# EAGLE design frontend8 (EAGLE 9.3.1)

## Sheet 1 of 3
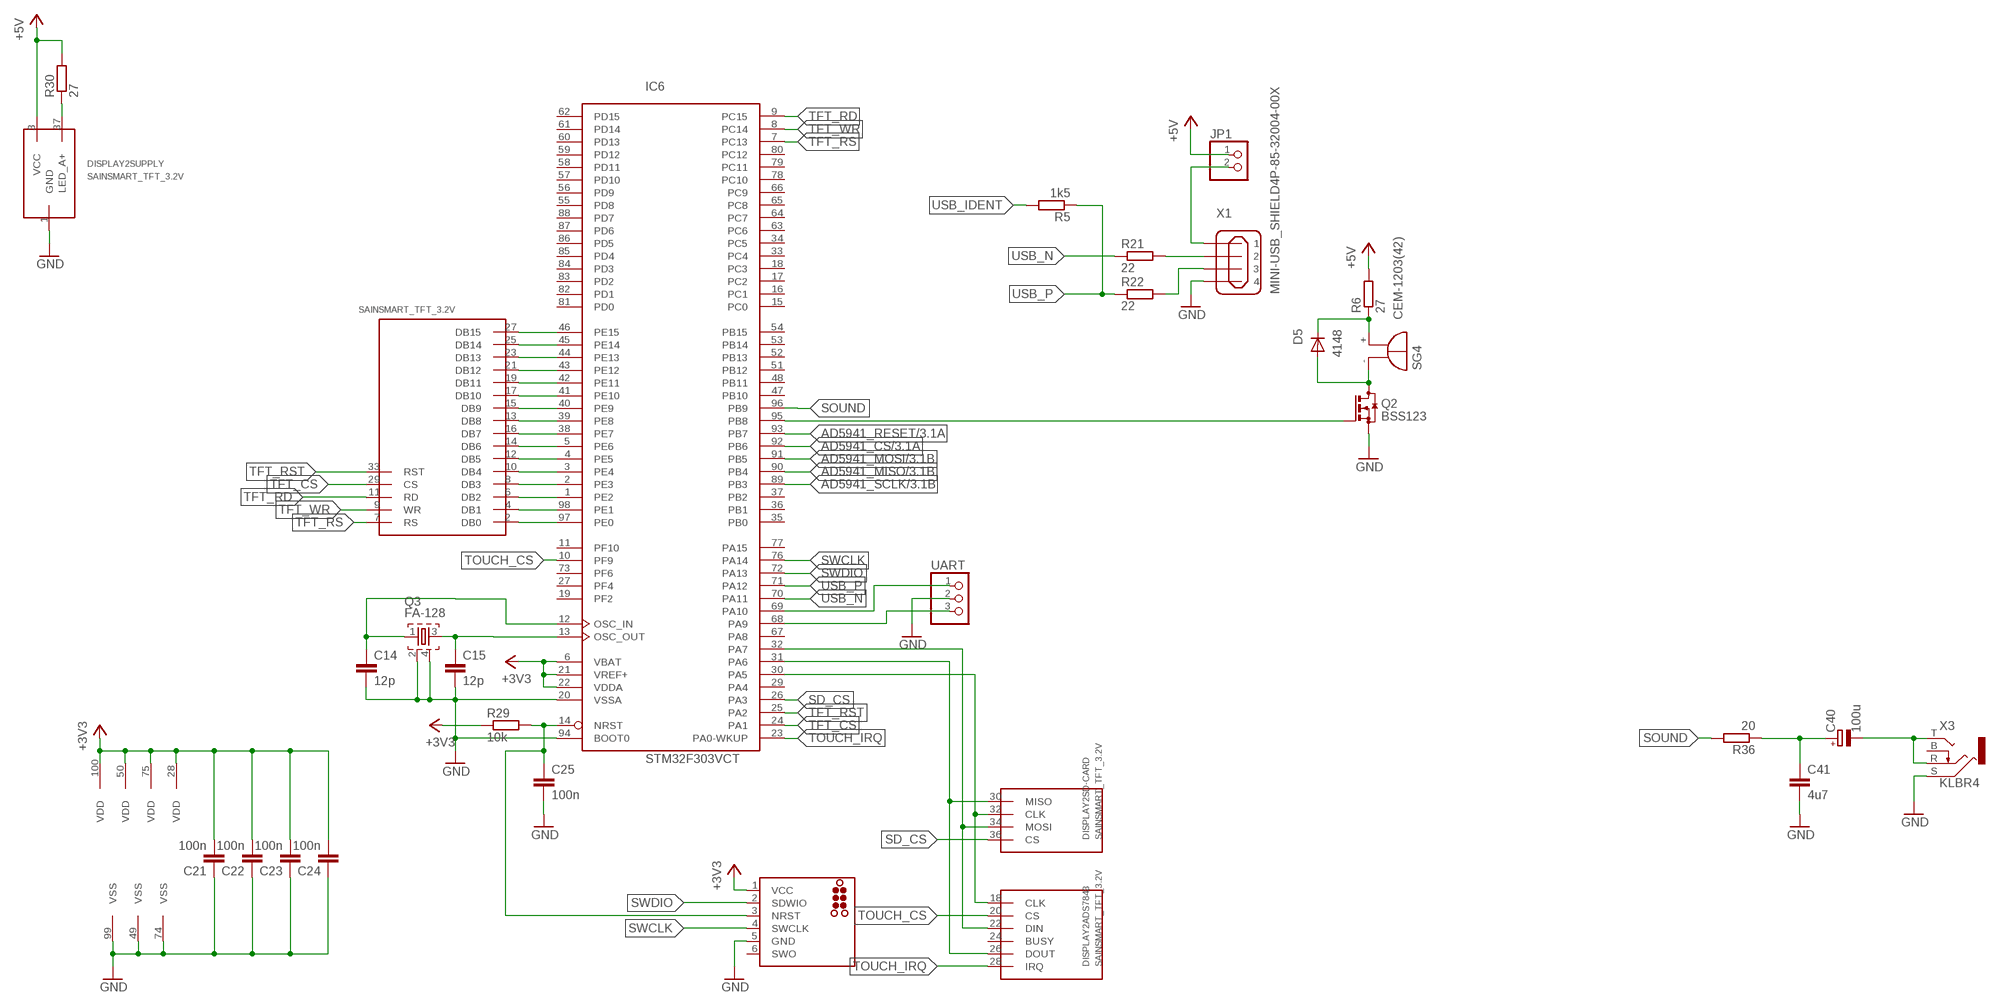
[diagram p0: schematic, sheet 1]

### Parts
C14  12p  C-EUC0603K  [C0603K]
C15  12p  C-EUC0603K  [C0603K]
C21  100n  C-EUC0603K  [C0603K]
C22  100n  C-EUC0603K  [C0603K]
C23  100n  C-EUC0603K  [C0603K]
C24  100n  C-EUC0603K  [C0603K]
C25  100n  C-EUC0603K  [C0603K]
C40  100u  CPOL-EUE2.5-5  [E2,5-5]
C41  4u7  C-EUC1206K  [C1206K]
D5  4148  DIODE-SOD123  [SOD123]
DISPLAY2  SAINSMART_TFT_3.2V  [SAINSMART_ANGLED]
IC6  STM32F303VCT  [LQFP100]
J1  TC2030-MCP  [TC2030-MCP]
JP1  PINHD-1X2  [1X02]
Q2  BSS123  [SOT23]
Q3  FA-128  [FA-128]
R5  1k5  R-EU_R0603  [R0603]
R6  27  R-EU_R1206  [R1206]
R21  22  R-EU_R0603  [R0603]
R22  22  R-EU_R0603  [R0603]
R29  10k  R-EU_R0603  [R0603]
R30  27  R-EU_R1206  [R1206]
R36  20  R-EU_R1206  [R1206]
SG4  CEM-1203(42)  F/QMBIII  [F/QMBIII]
UART  PINHD-1X3  [1X03]
X1  MINI-USB_SHIELD4P-85-32004-00X  [85-32004-00X]
X3  KLBR4  [KLBR4]

### Nets
+3V3: C21.2 C22.2 C23.2 C24.2 IC6.6(VBAT) IC6.21(VREF+) IC6.22(VDDA) IC6.28(VDD) IC6.50(VDD) IC6.75(VDD) IC6.100(VDD) J1.1(VCC) R29.1 ; also sheet 2,3
+5V: DISPLAY2.3(SUPPLY:VCC) JP1.1 R6.2 R30.2 ; also sheet 2
AD5941_CS: IC6.92(PB6) ; also sheet 3
AD5941_MISO: IC6.90(PB4) ; also sheet 3
AD5941_MOSI: IC6.91(PB5) ; also sheet 3
AD5941_RESET: IC6.93(PB7) ; also sheet 3
AD5941_SCLK: IC6.89(PB3) ; also sheet 3
GND: C14.2 C15.2 C21.1 C22.1 C23.1 C24.1 C25.2 C41.2 DISPLAY2.1(SUPPLY:GND) IC6.20(VSSA) IC6.49(VSS) IC6.74(VSS) IC6.94(BOOT0) IC6.99(VSS) J1.5(GND) Q2.2(S) Q3.2 Q3.4 UART.2 X1.4 X3.S ; also sheet 2,3
N$22: C40.+ C41.1 R36.1
N$38: IC6.95(PB8) Q2.1(G)
N$41: DISPLAY2.2(SSD1289:DB0) IC6.97(PE0)
N$42: C40.- X3.R X3.T
N$43: DISPLAY2.4(SSD1289:DB1) IC6.98(PE1)
N$44: DISPLAY2.6(SSD1289:DB2) IC6.1(PE2)
N$45: DISPLAY2.8(SSD1289:DB3) IC6.2(PE3)
N$46: DISPLAY2.22(ADS7843:DIN) DISPLAY2.34(SD-CARD:MOSI) IC6.32(PA7)
N$47: DISPLAY2.10(SSD1289:DB4) IC6.3(PE4)
N$48: DISPLAY2.12(SSD1289:DB5) IC6.4(PE5)
N$49: DISPLAY2.14(SSD1289:DB6) IC6.5(PE6)
N$50: DISPLAY2.16(SSD1289:DB7) IC6.38(PE7)
N$51: DISPLAY2.26(ADS7843:DOUT) DISPLAY2.30(SD-CARD:MISO) IC6.31(PA6)
N$52: DISPLAY2.18(ADS7843:CLK) DISPLAY2.32(SD-CARD:CLK) IC6.30(PA5)
N$53: C14.1 IC6.12(OSC_IN) Q3.1
N$54: C15.1 IC6.13(OSC_OUT) Q3.3
N$55: R21.2 X1.2
N$56: R22.2 X1.3
N$60: C25.1 IC6.14(NRST) J1.3(NRST) R29.2
N$61: DISPLAY2.37(SUPPLY:LED_A+) R30.1
N$62: DISPLAY2.13(SSD1289:DB8) IC6.39(PE8)
N$63: DISPLAY2.15(SSD1289:DB9) IC6.40(PE9)
N$64: DISPLAY2.17(SSD1289:DB10) IC6.41(PE10)
N$65: DISPLAY2.19(SSD1289:DB11) IC6.42(PE11)
N$66: JP1.2 X1.1
N$67: D5.C R6.1 SG4.+(-)
N$68: DISPLAY2.21(SSD1289:DB12) IC6.43(PE12)
N$69: DISPLAY2.23(SSD1289:DB13) IC6.44(PE13)
N$70: DISPLAY2.25(SSD1289:DB14) IC6.45(PE14)
N$71: DISPLAY2.27(SSD1289:DB15) IC6.46(PE15)
N$72: D5.A Q2.3(D) SG4.-(+)
RX: IC6.69(PA10) UART.1
SD_CS: DISPLAY2.36(SD-CARD:CS) IC6.26(PA3)
SOUND: IC6.96(PB9) R36.2
SWCLK: IC6.76(PA14) J1.4(SWCLK)
SWDIO: IC6.72(PA13) J1.2(SDWIO)
TFT_CS: DISPLAY2.29(SSD1289:CS) IC6.24(PA1)
TFT_RD: DISPLAY2.11(SSD1289:RD) IC6.9(PC15)
TFT_RS: DISPLAY2.7(SSD1289:RS) IC6.7(PC13)
TFT_RST: DISPLAY2.33(SSD1289:RST) IC6.25(PA2)
TFT_WR: DISPLAY2.9(SSD1289:WR) IC6.8(PC14)
TOUCH_CS: DISPLAY2.20(ADS7843:CS) IC6.10(PF9)
TOUCH_IRQ: DISPLAY2.28(ADS7843:IRQ) IC6.23(PA0-WKUP)
TX: IC6.68(PA9) UART.3
USB_IDENT: R5.2
USB_N: IC6.70(PA11) R21.1
USB_P: IC6.71(PA12) R5.1 R22.1
Unconnected: DISPLAY2.24(ADS7843:BUSY) IC6.11(PF10) IC6.15(PC0) IC6.16(PC1) IC6.17(PC2) IC6.18(PC3) IC6.19(PF2) IC6.27(PF4) IC6.29(PA4) IC6.33(PC4) IC6.34(PC5) IC6.35(PB0) IC6.36(PB1) IC6.37(PB2) IC6.47(PB10) IC6.48(PB11) IC6.51(PB12) IC6.52(PB13) IC6.53(PB14) IC6.54(PB15) IC6.55(PD8) IC6.56(PD9) IC6.57(PD10) IC6.58(PD11) IC6.59(PD12) IC6.60(PD13) IC6.61(PD14) IC6.62(PD15) IC6.63(PC6) IC6.64(PC7) IC6.65(PC8) IC6.66(PC9) IC6.67(PA8) IC6.73(PF6) IC6.77(PA15) IC6.78(PC10) IC6.79(PC11) IC6.80(PC12) IC6.81(PD0) IC6.82(PD1) IC6.83(PD2) IC6.84(PD3) IC6.85(PD4) IC6.86(PD5) IC6.87(PD6) IC6.88(PD7) J1.6(SWO) X1.M1(S1) X1.M2(S2) X3.B

## Sheet 2 of 3
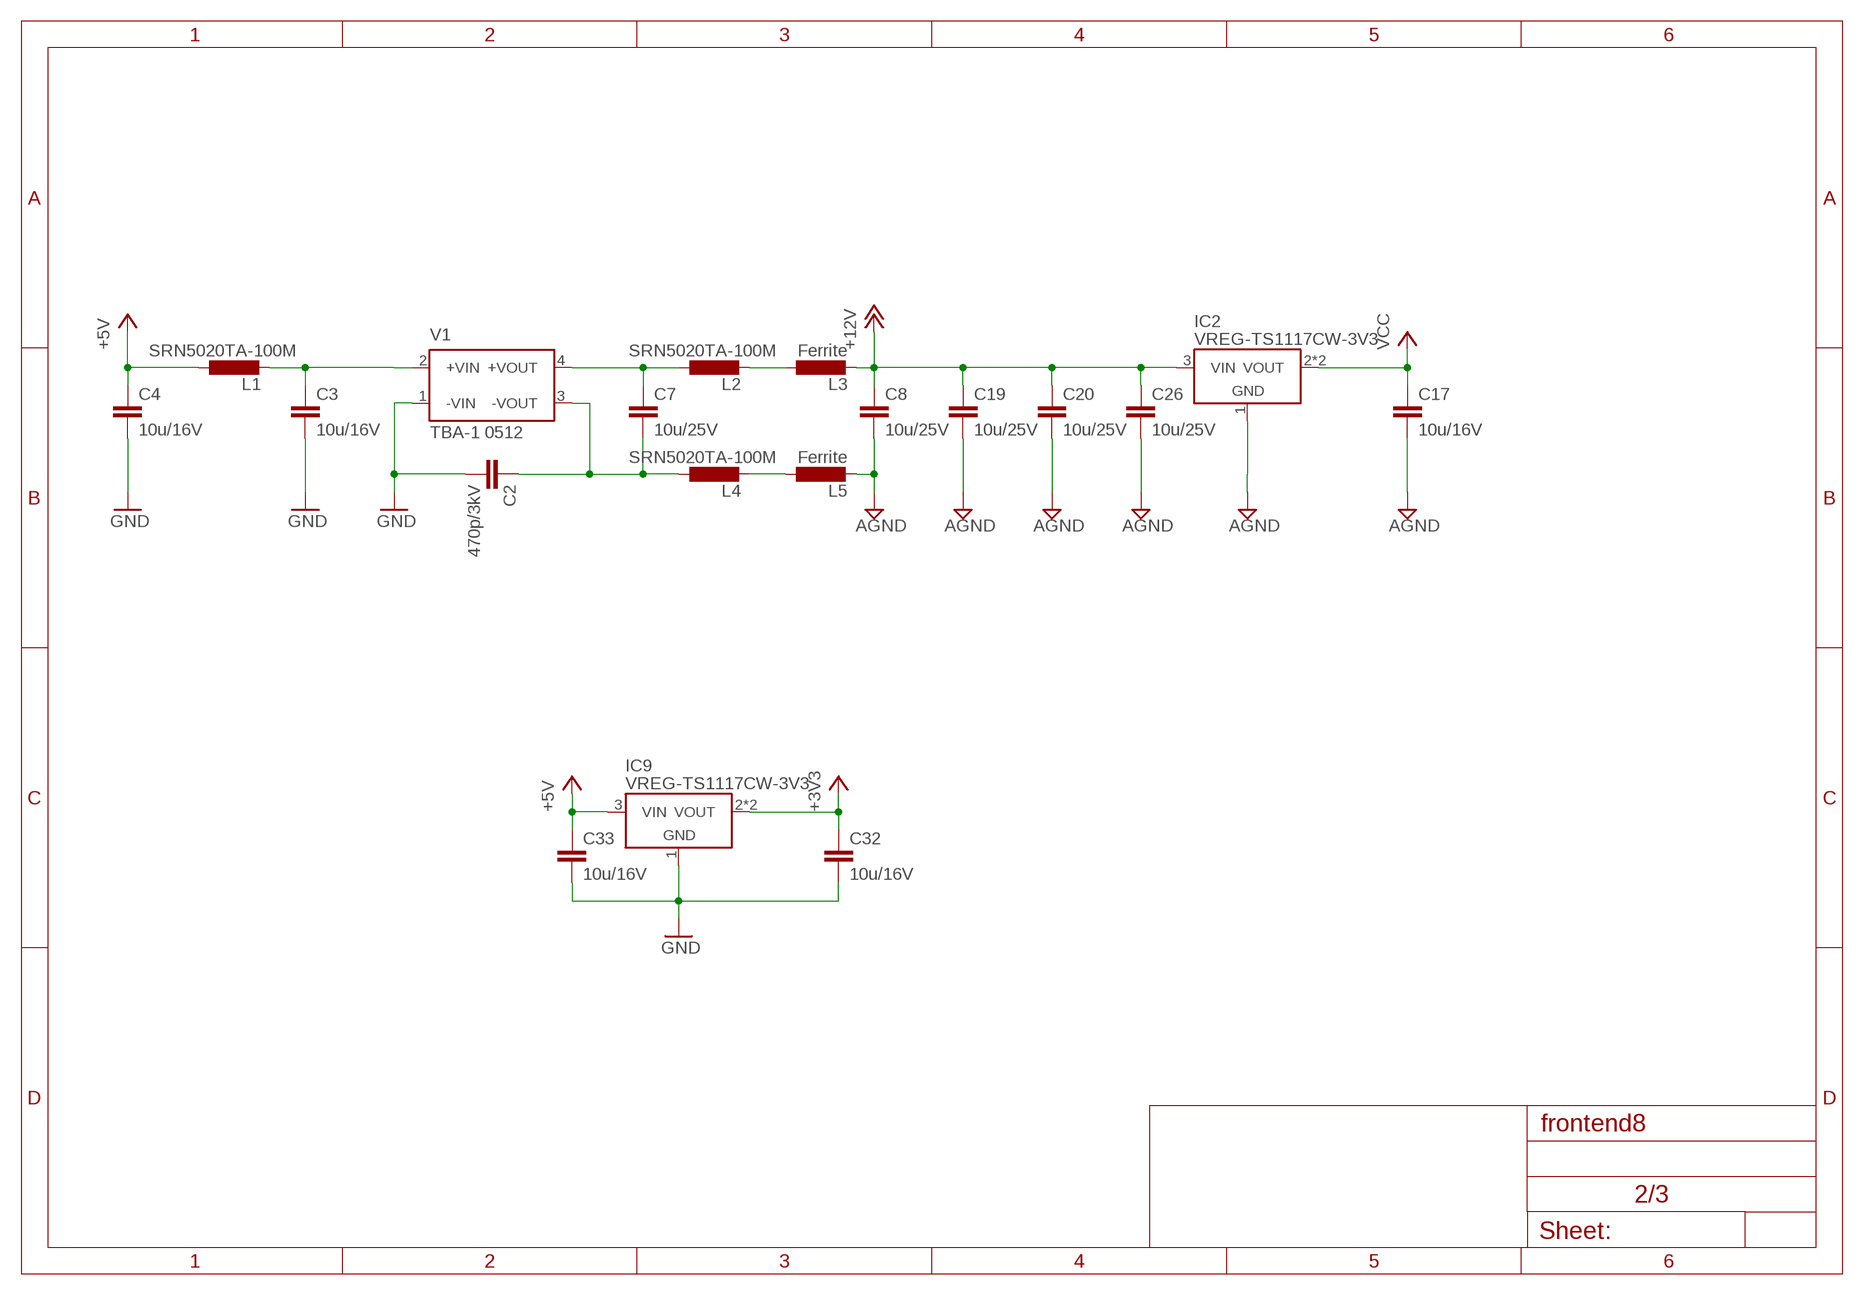
[diagram p1: schematic, sheet 2]

### Parts
C2  470p/3kV  C-EUC1812  [C1812]
C3  10u/16V  C-EUC1206K  [C1206K]
C4  10u/16V  C-EUC1206K  [C1206K]
C7  10u/25V  C-EUC1206K  [C1206K]
C8  10u/25V  C-EUC1206K  [C1206K]
C17  10u/16V  C-EUC1206K  [C1206K]
C19  10u/25V  C-EUC1206K  [C1206K]
C20  10u/25V  C-EUC1206K  [C1206K]
C26  10u/25V  C-EUC1206K  [C1206K]
C32  10u/16V  C-EUC1206K  [C1206K]
C33  10u/16V  C-EUC1206K  [C1206K]
IC2  VREG-TS1117CW-3V3  [SOT223]
IC9  VREG-TS1117CW-3V3  [SOT223]
L1  SRN5020TA-100M  SRN5040  [SRN5040]
L2  SRN5020TA-100M  SRN5040  [SRN5040]
L3  Ferrite  INDUCTOR0603  [R0603]
L4  SRN5020TA-100M  SRN5040  [SRN5040]
L5  Ferrite  INDUCTOR0603  [R0603]
V1  TBA-1 0512  TME0505S  [TME]

### Nets
+3V3: C32.1 IC9.2(VOUT) IC9.4(VOUT) ; also sheet 1,3
+5V: C4.1 C33.1 IC9.3(VIN) L1.P$1 ; also sheet 1
+12V: C8.1 C19.1 C20.1 C26.1 IC2.3(VIN) L3.2 ; also sheet 3
AGND: C8.2 C17.2 C19.2 C20.2 C26.2 IC2.1(GND) L5.2 ; also sheet 3
GND: C2.2 C3.2 C4.2 C32.2 C33.2 IC9.1(GND) V1.1(-VIN) ; also sheet 1,3
N$20: C3.1 L1.P$2 V1.2(+VIN)
N$25: C7.1 L2.P$1 V1.4(+VOUT)
N$26: C2.1 C7.2 L4.P$1 V1.3(-VOUT)
N$36: L2.P$2 L3.1
N$58: L4.P$2 L5.1
VCC: C17.1 IC2.2(VOUT) IC2.4(VOUT) ; also sheet 3

## Sheet 3 of 3
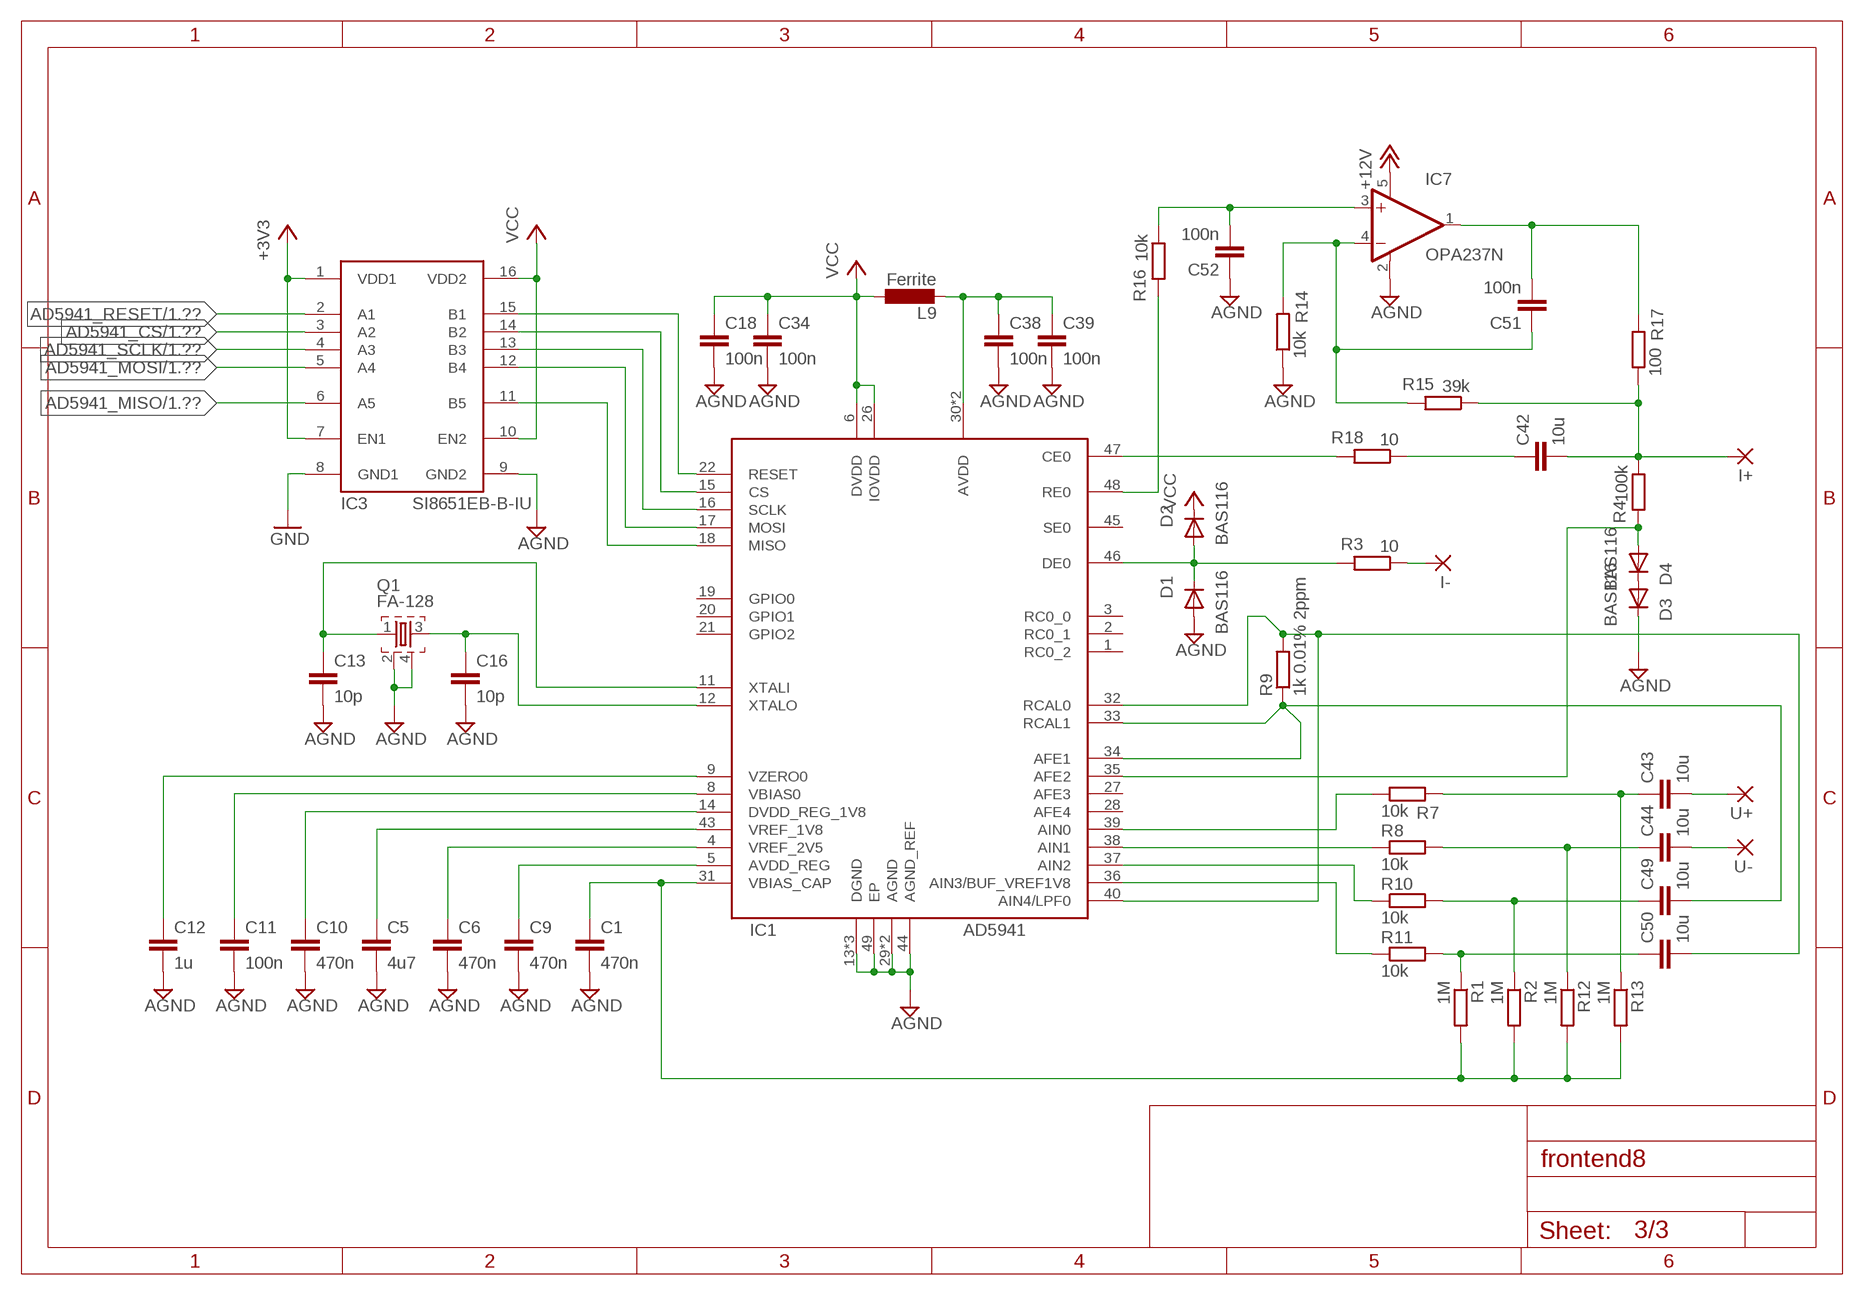
[diagram p2: schematic, sheet 3]

### Parts
C1  470n  C-EUC0603K  [C0603K]
C5  4u7  C-EUC0603K  [C0603K]
C6  470n  C-EUC0603K  [C0603K]
C9  470n  C-EUC0603K  [C0603K]
C10  470n  C-EUC0603K  [C0603K]
C11  100n  C-EUC0603K  [C0603K]
C12  1u  C-EUC0603K  [C0603K]
C13  10p  C-EUC0603K  [C0603K]
C16  10p  C-EUC0603K  [C0603K]
C18  100n  C-EUC0603K  [C0603K]
C34  100n  C-EUC0603K  [C0603K]
C38  100n  C-EUC0603K  [C0603K]
C39  100n  C-EUC0603K  [C0603K]
C42  10u  C-EUC1206K  [C1206K]
C43  10u  C-EUC1206K  [C1206K]
C44  10u  C-EUC1206K  [C1206K]
C49  10u  C-EUC1206K  [C1206K]
C50  10u  C-EUC1206K  [C1206K]
C51  100n  C-EUC0603K  [C0603K]
C52  100n  C-EUC0603K  [C0603K]
D1  BAS116  DIODE-SOD123  [SOD123]
D2  BAS116  DIODE-SOD123  [SOD123]
D3  BAS116  DIODE-SOD123  [SOD123]
D4  BAS116  DIODE-SOD123  [SOD123]
I+  2,54/1,1  [2,54/1,1]
I-  2,54/1,1  [2,54/1,1]
IC1  AD5941  [QFN50P700X700X80-49T510N]
IC3  SI8651EB-B-IU  [SOP63P600X175-16N]
IC7  OPA237N  [SOT23-5]
L9  Ferrite  INDUCTOR0603  [R0603]
Q1  FA-128  [FA-128]
R1  1M  R-EU_R0603  [R0603]
R2  1M  R-EU_R0603  [R0603]
R3  10  R-EU_R0603  [R0603]
R4  100k  R-EU_R0603  [R0603]
R7  10k  R-EU_R0603  [R0603]
R8  10k  R-EU_R0603  [R0603]
R9  1k 0.01% 2ppm  R-EU_M0805  [M0805]
R10  10k  R-EU_R0603  [R0603]
R11  10k  R-EU_R0603  [R0603]
R12  1M  R-EU_R0603  [R0603]
R13  1M  R-EU_R0603  [R0603]
R14  10k  R-EU_R0603  [R0603]
R15  39k  R-EU_R0603  [R0603]
R16  10k  R-EU_R0603  [R0603]
R17  100  R-EU_R0603  [R0603]
R18  10  R-EU_R0603  [R0603]
U+  2,54/1,1  [2,54/1,1]
U-  2,54/1,1  [2,54/1,1]

### Nets
+3V3: IC3.1(VDD1) IC3.7(EN1) ; also sheet 1,2
+12V: IC7.5(V+) ; also sheet 2
AD5941_CS: IC3.3(A2) ; also sheet 1
AD5941_MISO: IC3.6(A5) ; also sheet 1
AD5941_MOSI: IC3.5(A4) ; also sheet 1
AD5941_RESET: IC3.2(A1) ; also sheet 1
AD5941_SCLK: IC3.4(A3) ; also sheet 1
AGND: C1.2 C5.2 C6.2 C9.2 C10.2 C11.2 C12.2 C13.2 C16.2 C18.2 C34.2 C38.2 C39.2 C52.1 D1.A IC1.13(DGND) IC1.23(DGND) IC1.25(DGND) IC1.29(AGND) IC1.42(AGND) IC1.44(AGND_REF) IC1.49(EP) IC3.9(GND2) IC7.2(V-) Q1.2 Q1.4 R14.1 ; also sheet 2
GND: IC3.8(GND1) ; also sheet 1,2
I+: C42.2 I+.1(P) R4.1 R15.1 R17.1
I-: I-.1(P) R3.1
N$1: C1.1 IC1.31(VBIAS_CAP) R1.2 R2.2 R12.2 R13.2
N$2: C6.1 IC1.4(VREF_2V5)
N$3: C5.1 IC1.43(VREF_1V8)
N$4: C9.1 IC1.5(AVDD_REG)
N$5: C10.1 IC1.14(DVDD_REG_1V8)
N$6: C11.1 IC1.8(VBIAS0)
N$7: C12.1 IC1.9(VZERO0)
N$8: C16.1 IC1.12(XTALO) Q1.3
N$9: C13.1 IC1.11(XTALI) Q1.1
N$10: IC1.17(MOSI) IC3.12(B4)
N$11: C42.1 R18.1
N$12: IC1.22(RESET) IC3.15(B1)
N$13: IC1.15(CS) IC3.14(B2)
N$14: IC1.16(SCLK) IC3.13(B3)
N$15: IC1.18(MISO) IC3.11(B5)
N$16: C38.1 C39.1 IC1.30(AVDD) IC1.41(AVDD) L9.2
N$17: IC1.47(CE0) R18.2
N$18: IC1.39(AIN0) R7.1
N$19: IC1.38(AIN1) R8.1
N$21: C44.1 R8.2 R12.1
N$23: C43.1 R7.2 R13.1
N$24: C49.2 IC1.33(RCAL1) IC1.34(AFE1) R9.1
N$27: IC1.37(AIN2) R10.1
N$28: IC1.36(AIN3/BUF_VREF1V8) R11.1
N$29: C50.1 R1.1 R11.2
N$30: C49.1 R2.1 R10.2
N$31: IC1.48(RE0) R16.2
N$32: C52.2 IC7.3(+IN) R16.1
N$33: C51.1 IC7.4(-IN) R14.2 R15.2
N$34: C51.2 IC7.1(OUT) R17.2
N$35: D1.C D2.A IC1.46(DE0) R3.2
N$37: D4.A IC1.35(AFE2) R4.2
N$39: D3.A D4.C
N$40: D3.C
N$59: C50.2 IC1.32(RCAL0) IC1.40(AIN4/LPF0) R9.2
U+: C43.2 U+.1(P)
U-: C44.2 U-.1(P)
VCC: C18.1 C34.1 D2.C IC1.6(DVDD) IC1.26(IOVDD) IC3.10(EN2) IC3.16(VDD2) L9.1 ; also sheet 2
Unconnected: IC1.1(RC0_2) IC1.2(RC0_1) IC1.3(RC0_0) IC1.19(GPIO0) IC1.20(GPIO1) IC1.21(GPIO2) IC1.27(AFE3) IC1.28(AFE4) IC1.45(SE0)

## Library data of the parts
C1 C3-C26 C32-C34 C38 C39 C41 C51 C52 = rcl:C-EU: CAPACITOR, European symbol
C2 C42-C44 C49 C50 = resistor:C-EU: CAPACITOR, European symbol
C40 = rcl:CPOL-EU: POLARIZED CAPACITOR, European symbol
D1-D5 = diode:DIODE-: DIODE
DISPLAY2 = sainsmart:SAINSMART_TFT_3.2
I+ I- U+ U- = wirepad:2,54/1,1: THROUGH-HOLE PAD
IC1 = custom-ic:AD5941
IC2 IC9 = we-power-mod:VREG: Voltage Regulators (LDOs, Switching Converters...) LDOs Taiwan Semi TS1117 800mA max 15V - compatible On Semi NCP1117 1A max 20V - compatible Diodes AP2111H 0.6A max 6V (0.25V@0.6A) - compatible Diodes AP2114H 1A max 6V (0.45V@1A) Taiwan Semi TS9011 250mA max 12V - compatible Diodes AP2210 300mA max 15V - compatible Microchip MCP1700 250mA max 6.5V - compatible Microchip MCP1702 250mA max 13V - compatible Microchip MCP1703 250mA max 16V - compatible Microchip MCP1754 150mA max 16V Taiwan Semi TS5204 150mA max 16V (low noise) DC/DC Converter Modules Recom R-78Ex.x-1.0-W36 1A max 28V - compatible CUI V78xx-2000 2A max 18V Murata OKI-78SR-x.x/1.5-W36 1.5A max 36V
IC3 = custom-ic:SI8651
IC6 = micro-stm_v3:STM32F303V*T: ARM 32-bit Cortex™-M3 CPU 72 MHz maximum frequency 128 to 256 Kbytes of Flash memory 32 to 40 kbytes of SRAM 87 GPIOs 2.0 to 3.6 V application supply
IC7 = burr-brown:OPA237: Operational Amplifiers Single-Supply, MicroAmplifier(TM) Series; MF: TEXAS INSTRUMENTS; MPN: OPA237NA/250; OC_FARNELL: 4625298; OC_NEWARK: 35C1874
J1 = tag-connect:TC2030: TAG-CONNECT ICSP Connector Manufacturer: Tag-Connect <http://www.tag-connect.com> Cable for easy In-Circuit Serial Programming. Designed for Microchip ICD2, suitable for many others. Two variants - one "with legs" (for hands-free fit on PCB) and another "without legs" for quick programming. PAD Description 1 MCLR/Vpp 2 Vdd 3 GND 4 PGD (ISPDAT) 5 PGC (ISPCLK) 6 nc (used for LVP) ©2009 ROFA.cz - modified and updated by Robert Darlington ‹rdarlington@gmail.com›
JP1 = pinhead:PINHD-1X2: PIN HEADER
L1 L2 L4 = custom-ic:SRN5040
L3 L5 L9 = rf:INDUCTOR
Q1 Q3 = crystal:FA-: MHz RANGE CRYSTAL UNIT Source: Epson Toyocom
Q2 = transistor-small-signal:BSS123: N-CHANNEL MOS FET
R1-R4 R7 R8 R10-R18 R36 = rcl:R-EU_: RESISTOR, European symbol
R5 R6 R9 R21 R22 R29 R30 = resistor:R-EU_: RESISTOR, European symbol
SG4 = buzzer:F/QMBIII: BUZZER Source: Buerklin; OC_FARNELL: unknown; OC_NEWARK: unknown
UART = pinhead:PINHD-1X3: PIN HEADER
V1 = traco-electronic:TME?*: DC/DC Converter TME Series 1 Watt Source: www.tracopower.com .. tme.pdf; MPN: TME 0505S; OC_FARNELL: 1007538; OC_NEWARK: 51R5321
X1 = con-cypressindustries:MINI-USB_SHIELD4P-: MINI USB 4 Pol. Source: www.cypressindustries.com; OC_FARNELL: unknown; OC_NEWARK: unknown
X3 = con-lumberg:KLBR4: Jack connectors according to JISC 6560, 3.5 mm Klinkeneinbaukupplung nach JISC 6560, 3,5 mm, 3-polig/ stereo, abgewinkelte Ausführung, mit Öffner, für Leiterplatten Source: Data sheet <http://www.lumberg.com/Produkte/PDFs/KLBR4.pdf>; MPN: KLBR 4; OC_FARNELL: 1217016; OC_NEWARK: 97K2709

## Board
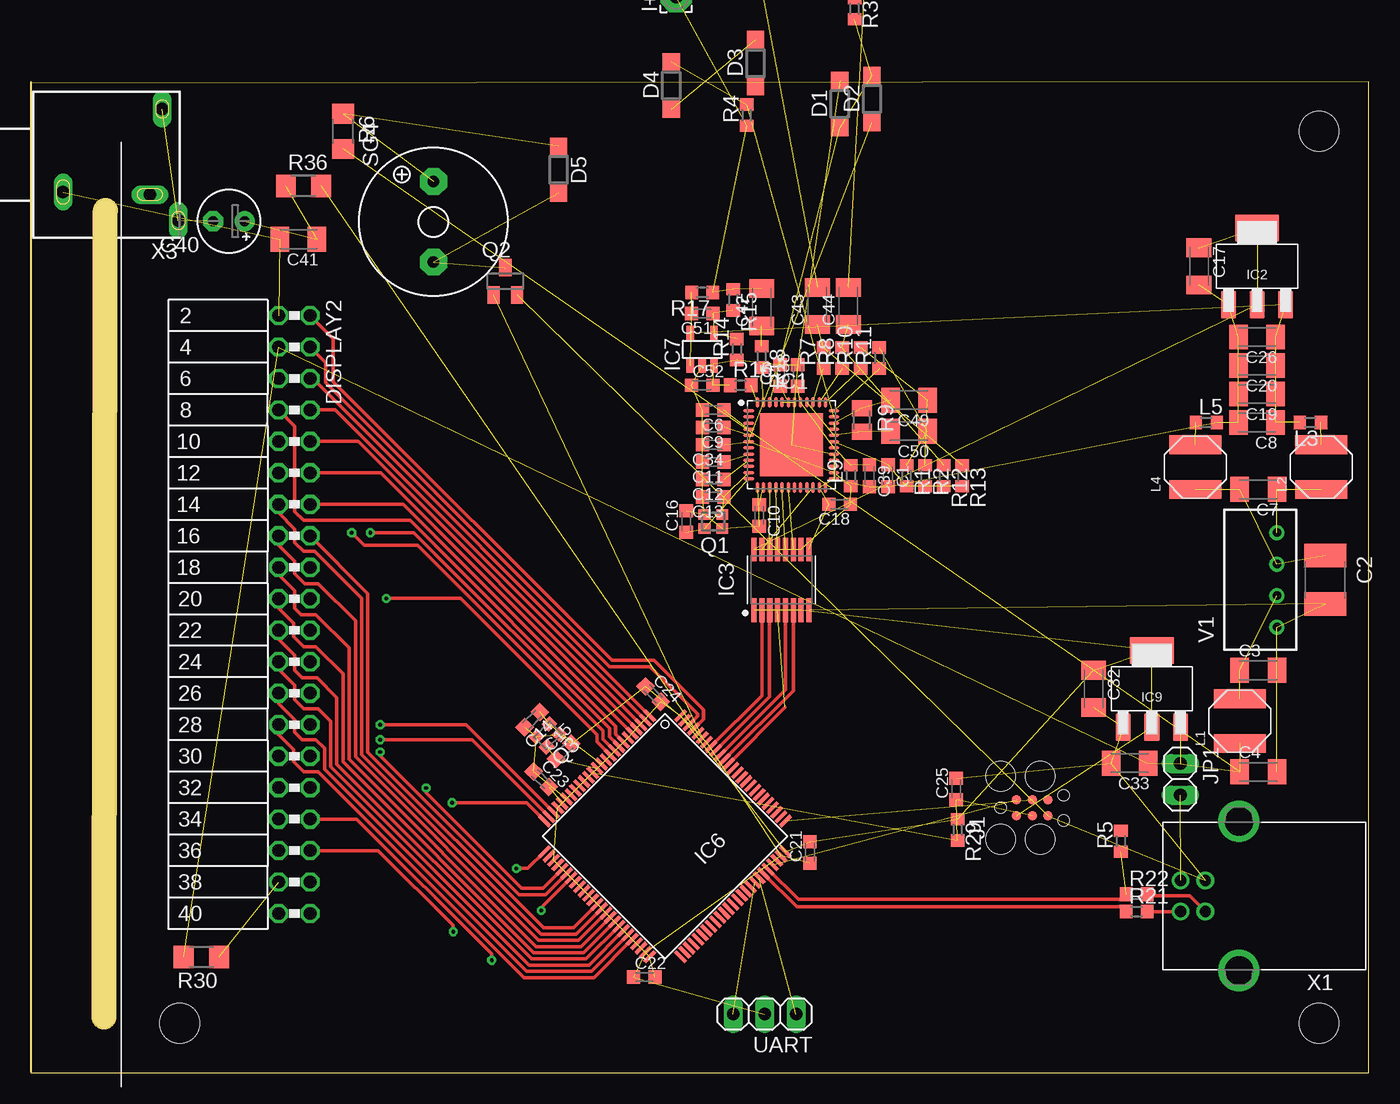
[diagram p3: board, top side]
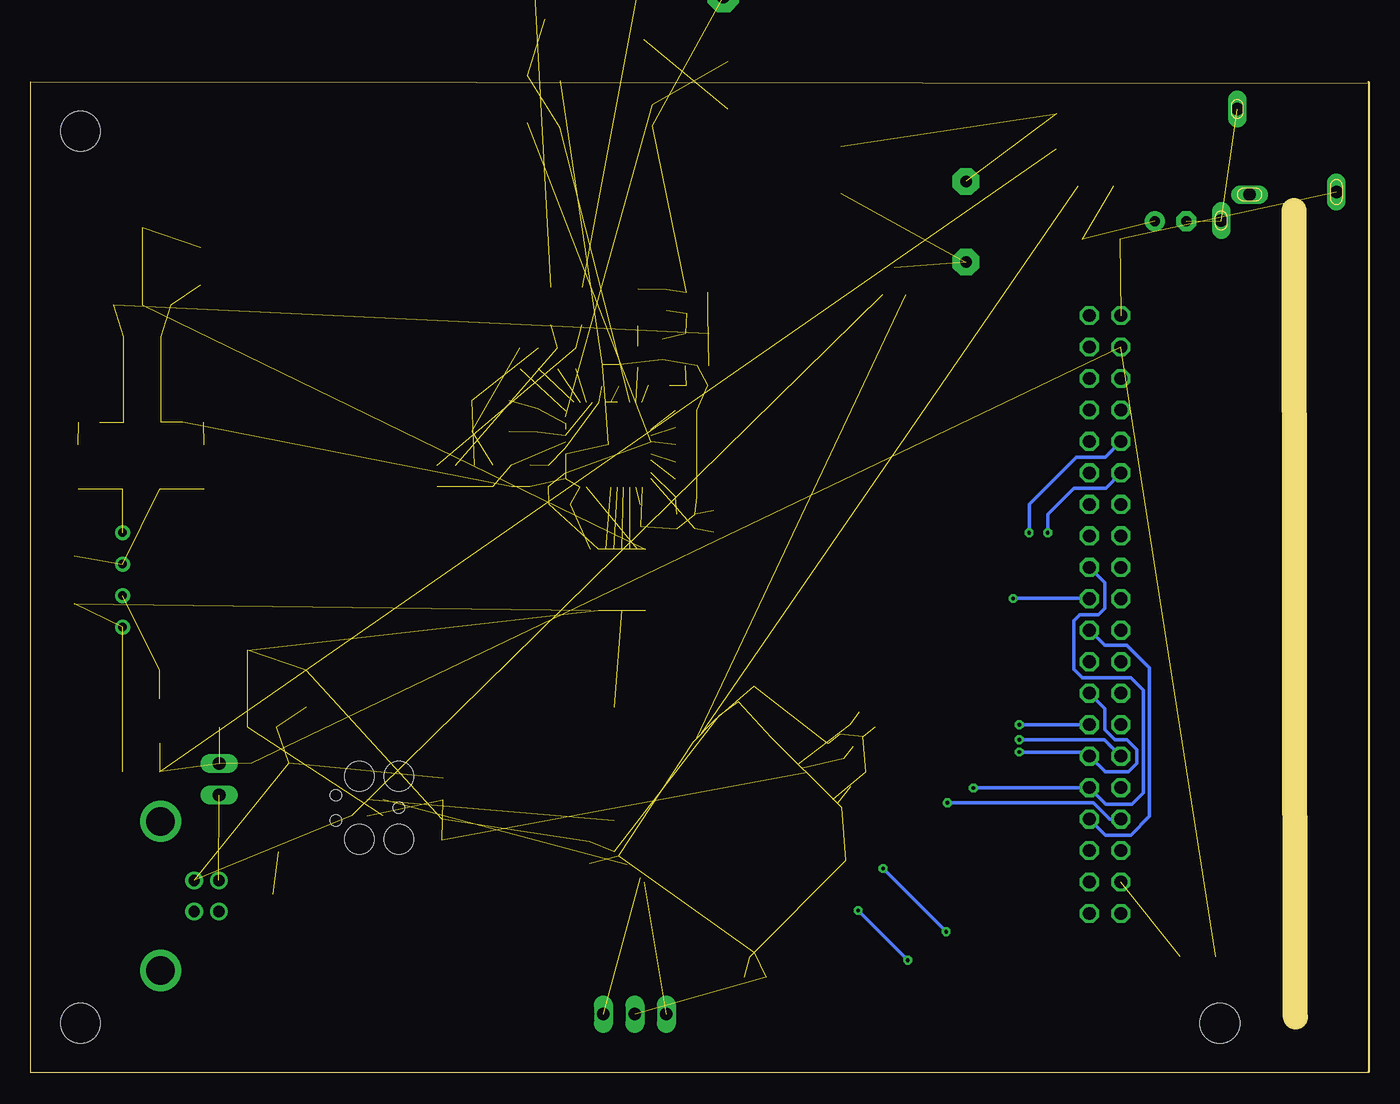
[diagram p4: board, bottom side, seen from below]

Size 108 x 80 mm. Coordinates in mm from the lower left corner, seen from the top.
Outline: 0,80 0,0.1
Outline: 0,0 108,0 108,80 0,79.9 0,0
Copper layers (1+2*15+16): Top 0.035mm / dielectric 0.2mm / Route2 0.0175mm / dielectric 1.064mm / Route15 0.0175mm / dielectric 0.2mm / Bottom 0.035mm
Design rules "JLCPCB4L_7628": minimum track width 6mil, minimum drill 0.3mm, track to track 3.5mil, track to pad 3.5mil, pad to pad 3.5mil, via to via 3.5mil, smd to smd 0mil, copper to edge 0.2mm, drill to drill 0.2mm, minimum pad ring 10mil, minimum via ring 8mil, stop-mask expansion 4mil, vias tented up to drill 0mil, thermal gap 10mil
Holes 3.2 mm at 104,4 104,76 12,4
tKeepout: area 101,73 to 107,79; area 101,1 to 107,7; area 9,1 to 15,7
Milling: 1 lines

### Footprints (pad centres in the part's own frame; a part is rotated, then mirrored left to right if it is on the bottom)
C0603K = smd 1.05 x 1.08: 1 -0.875,0; 2 0.875,0
C1812 = smd 1.9 x 3.4: 1 -1.95,0; 2 1.95,0
C1206K = smd 1.5 x 2: 1 -1.5,0; 2 1.5,0
E2,5-5 = drill 0.813 pad 1.6: + -1.27,0 | drill 0.813 pad 1.6 octagon: - 1.27,0
SOD123 = smd 1.4 x 1.4: A 1.9,0; C -1.9,0
SAINSMART_ANGLED = drill 1.016 octagon: 1 -24.13,0; 2 -24.13,2.54; 3 -21.59,0; 4 -21.59,2.54; 5 -19.05,0; 6 -19.05,2.54; 7 -16.51,0; 8 -16.51,2.54; 9 -13.97,0; 10 -13.97,2.54; 11 -11.43,0; 12 -11.43,2.54; 13 -8.89,0; 14 -8.89,2.54; 15 -6.35,0; 16 -6.35,2.54; 17 -3.81,0; 18 -3.81,2.54; 19 -1.27,0; 20 -1.27,2.54; 21 1.27,0; 22 1.27,2.54; 23 3.81,0; 24 3.81,2.54; 25 6.35,0; 26 6.35,2.54; 27 8.89,0; 28 8.89,2.54; 29 11.43,0; 30 11.43,2.54; 31 13.97,0; 32 13.97,2.54; 33 16.51,0; 34 16.51,2.54; 35 19.05,0; 36 19.05,2.54; 37 21.59,0; 38 21.59,2.54; 39 24.13,0; 40 24.13,2.54
2,54/1,1 = drill 1.118 pad 2.54 octagon: 1 0,0
QFN50P700X700X80-49T510N = smd 0.838 x 0.264: 1 -3.446,2.75; 2 -3.446,2.25; 3 -3.446,1.75; 4 -3.446,1.25; 5 -3.446,0.75; 6 -3.446,0.25; 7 -3.446,-0.25; 8 -3.446,-0.75; 9 -3.446,-1.25; 10 -3.446,-1.75; 11 -3.446,-2.25; 12 -3.446,-2.75; 25 3.446,-2.75; 26 3.446,-2.25; 27 3.446,-1.75; 28 3.446,-1.25; 29 3.446,-0.75; 30 3.446,-0.25; 31 3.446,0.25; 32 3.446,0.75; 33 3.446,1.25; 34 3.446,1.75; 35 3.446,2.25; 36 3.446,2.75 | smd 0.264 x 0.838: 13 -2.75,-3.446; 14 -2.25,-3.446; 15 -1.75,-3.446; 16 -1.25,-3.446; 17 -0.75,-3.446; 18 -0.25,-3.446; 19 0.25,-3.446; 20 0.75,-3.446; 21 1.25,-3.446; 22 1.75,-3.446; 23 2.25,-3.446; 24 2.75,-3.446; 37 2.75,3.446; 38 2.25,3.446; 39 1.75,3.446; 40 1.25,3.446; 41 0.75,3.446; 42 0.25,3.446; 43 -0.25,3.446; 44 -0.75,3.446; 45 -1.25,3.446; 46 -1.75,3.446; 47 -2.25,3.446; 48 -2.75,3.446 | smd 5.1 x 5.1: 49 0,0
SOT223 = smd 2.235 x 1.219: 1 -3.099,2.311; 2 -3.099,0; 3 -3.099,-2.311 | smd 2.2 x 3.6: 4 3.099,0
SOP63P600X175-16N = smd 1.901 x 0.41: 1 -2.455,2.223; 2 -2.455,1.587; 3 -2.455,0.953; 4 -2.455,0.318; 5 -2.455,-0.318; 6 -2.455,-0.953; 7 -2.455,-1.587; 8 -2.455,-2.223; 9 2.455,-2.223; 10 2.455,-1.587; 11 2.455,-0.953; 12 2.455,-0.318; 13 2.455,0.318; 14 2.455,0.953; 15 2.455,1.587; 16 2.455,2.223
LQFP100 = smd 0.3 x 1.2: 1 -6,-7.75; 2 -5.5,-7.75; 3 -5,-7.75; 4 -4.5,-7.75; 5 -4,-7.75; 6 -3.5,-7.75; 7 -3,-7.75; 8 -2.5,-7.75; 9 -2,-7.75; 10 -1.5,-7.75; 11 -1,-7.75; 12 -0.5,-7.75; 13 0,-7.75; 14 0.5,-7.75; 15 1,-7.75; 16 1.5,-7.75; 17 2,-7.75; 18 2.5,-7.75; 19 3,-7.75; 20 3.5,-7.75; 21 4,-7.75; 22 4.5,-7.75; 23 5,-7.75; 24 5.5,-7.75; 25 6,-7.75; 51 6,7.75; 52 5.5,7.75; 53 5,7.75; 54 4.5,7.75; 55 4,7.75; 56 3.5,7.75; 57 3,7.75; 58 2.5,7.75; 59 2,7.75; 60 1.5,7.75; 61 1,7.75; 62 0.5,7.75; 63 0,7.75; 64 -0.5,7.75; 65 -1,7.75; 66 -1.5,7.75; 67 -2,7.75; 68 -2.5,7.75; 69 -3,7.75; 70 -3.5,7.75; 71 -4,7.75; 72 -4.5,7.75; 73 -5,7.75; 74 -5.5,7.75; 75 -6,7.75 | smd 1.2 x 0.3: 26 7.75,-6; 27 7.75,-5.5; 28 7.75,-5; 29 7.75,-4.5; 30 7.75,-4; 31 7.75,-3.5; 32 7.75,-3; 33 7.75,-2.5; 34 7.75,-2; 35 7.75,-1.5; 36 7.75,-1; 37 7.75,-0.5; 38 7.75,0; 39 7.75,0.5; 40 7.75,1; 41 7.75,1.5; 42 7.75,2; 43 7.75,2.5; 44 7.75,3; 45 7.75,3.5; 46 7.75,4; 47 7.75,4.5; 48 7.75,5; 49 7.75,5.5; 50 7.75,6; 76 -7.75,6; 77 -7.75,5.5; 78 -7.75,5; 79 -7.75,4.5; 80 -7.75,4; 81 -7.75,3.5; 82 -7.75,3; 83 -7.75,2.5; 84 -7.75,2; 85 -7.75,1.5; 86 -7.75,1; 87 -7.75,0.5; 88 -7.75,0; 89 -7.75,-0.5; 90 -7.75,-1; 91 -7.75,-1.5; 92 -7.75,-2; 93 -7.75,-2.5; 94 -7.75,-3; 95 -7.75,-3.5; 96 -7.75,-4; 97 -7.75,-4.5; 98 -7.75,-5; 99 -7.75,-5.5; 100 -7.75,-6
SOT23-5 = smd 0.6 x 1.2: 1 -0.95,-1.306; 2 0,-1.306; 3 0.95,-1.306; 4 0.95,1.306; 5 -0.95,1.306
TC2030-MCP = smd 0.787 x 0.787: 1 1.27,-0.635; 2 1.27,0.635; 3 2.54,-0.635; 4 2.54,0.635; 5 3.81,-0.635; 6 3.81,0.635 | hole 0.889: 0,0; 5.08,-1.016; 5.08,1.016 | hole 2.375: 0,2.54; 0,-2.54; 3.175,-2.54; 3.175,2.54
1X02 = drill 1.016 long: 1 -1.27,0; 2 1.27,0
SRN5040 = smd 1.5 x 4.2: P$1 -1.8,0; P$2 1.8,0
R0603 = smd 1 x 1.1: 1 -0.85,0; 2 0.85,0
FA-128 = smd 0.95 x 0.85: 1 -0.725,-0.575; 2 0.725,-0.575; 3 0.725,0.575; 4 -0.725,0.575
SOT23 = smd 1 x 1.4: 1 -0.95,-1.1; 2 0.95,-1.1; 3 0,1.1
R1206 = smd 1.6 x 1.803: 1 -1.422,0; 2 1.422,0
M0805 = smd 1.3 x 1.6: 1 -0.95,0; 2 0.95,0
F/QMBIII = drill 0.914 pad 2.159 octagon: + 3.251,0; - -3.251,0
1X03 = drill 1.016 long: 1 -2.54,0; 2 0,0; 3 2.54,0
TME = drill 0.7 pad 1.1: 1 -3.81,0; 2 -1.27,0; 3 1.27,0; 4 3.81,0
85-32004-00X = drill 0.92 pad 1.27: 1 4.71,-1.25; 2 4.71,1.25; 3 2.71,1.25; 4 2.71,-1.25 | drill 2.3 pad 3: M1 0,6.02; M2 0,-6.02
KLBR4 = drill 1 pad 1.3 long: B -2.4,-3.5; S -2.2,3.5 | drill 1 pad 1.2 long: R -4.5,-5.8; T 4.5,-4.5

### Placement (x,y rotation side)
C1  69.2,48.2 270 top
C2  104.5,39.8 270 top
C3  99.1,32.5 0 top
C4  99.1,24.3 0 top
C5  60.5,56.3 90 top
C6  55.1,53.5 180 top
C7  99.1,47.1 180 top
C8  99,52.5 180 top
C9  55.1,52.1 180 top
C10  58.8,45 270 top
C11  55.1,49.3 180 top
C12  55.1,47.9 180 top
C13  55.1,46.5 180 top
C14  40.47,28.51 225 top
C15  43.01,25.97 45 top
C16  52.9,44.5 90 top
C17  94.3,65.1 270 top
C18  65.3,45.9 180 top
C19  99,54.8 180 top
C20  99,57.1 180 top
C21  62.9,17.8 90 top
C22  49.53,7.73 0 top
C23  41.2,23.7 315 top
C24  50.24,30.58 315 top
C25  74.7,22.93 90 top
C26  99,59.4 180 top
C32  85.8,31 270 top
C33  88.7,25 180 top
C34  55.1,50.7 180 top
C38  61.9,56.3 90 top
C39  67.7,48.2 270 top
C40  15.98,68.75 180 top
C41  21.59,67.29 180 top
C42  59,61.8 90 top
C43  63.5,61.9 90 top
C44  66,61.9 90 top
C49  70.9,54.3 180 top
C50  70.9,51.8 180 top
C51  54.2,61.3 180 top
C52  54.2,55.5 0 top
D1  65.3,78.2 90 top
D2  67.9,78.6 90 top
D3  58.5,81.5 90 top
D4  51.7,79.7 90 top
D5  42.6,72.9 270 top
DISPLAY2  20,37 270 top
I+  52.1,86.9 90 top  (outside the outline)
I-  62.3,98.4 90 top  (outside the outline)
IC1  61.4,50.7 0 top
IC2  99,65.1 90 top
IC3  60.6,39.8 90 top
IC6  51.2,19.1 225 top
IC7  54.2,58.4 0 top
IC9  90.5,31 90 top
J1  78.3,21.4 0 top
JP1  92.8,23.7 270 top
L1  97.6,28.4 90 top
L2  104.2,48.9 90 top
L3  103.3,52.5 180 top
L4  94,48.9 90 top
L5  94.9,52.5 0 top
L9  66.2,48.2 90 top
Q1  55.1,44.5 180 top
Q2  38.3,63.9 0 top
Q3  41.74,27.24 225 top
R1  70.7,48.2 270 top
R2  72.2,48.2 270 top
R3  66.5,85.9 270 top  (outside the outline)
R4  57.8,77.3 90 top
R5  88,18.7 90 top
R6  25.2,76 270 top
R7  64,57.7 90 top
R8  65.5,57.7 90 top
R9  67.1,52.7 270 top
R10  67,57.7 90 top
R11  68.5,57.7 90 top
R12  73.7,48.2 270 top
R13  75.2,48.2 270 top
R14  57,58.4 90 top
R15  56.7,62.4 270 top
R16  57.3,55.5 0 top
R17  54.2,63 180 top
R18  59,57.8 270 top
R21  89.28,13.02 0 top
R22  89.28,14.42 0 top
R29  74.82,19.62 270 top
R30  13.76,9.37 180 top
R36  22.01,71.59 0 top
SG4  32.5,68.7 90 top
U+  55,108.9 90 top  (outside the outline)
U-  68.9,116.9 90 top  (outside the outline)
UART  59.23,4.74 180 top
V1  100.6,39.8 90 top
X1  97.53,14.29 180 top
X3  6.1,73.3 90 top

### Tracks (layer width: path | path; a pad name or v marks a point on that pad's centre or on a via)
+3V3  (17 unrouted)
+5V  (7 unrouted)
+12V  (6 unrouted)
AD5941_CS
  Top 0.3: IC6.92 59.65,30.38 IC3.3
AD5941_MISO
  Top 0.3: IC6.90 61.55,30.87 IC3.6
AD5941_MOSI
  Top 0.3: IC6.91 60.92,30.94 IC3.5
AD5941_RESET
  Top 0.3: IC6.93 59.01,30.45 IC3.2
AD5941_SCLK  (1 unrouted)
  Top 0.3: IC6.89 60.89,29.5
AGND  (33 unrouted)
GND  (25 unrouted)
I+  (4 unrouted)
I-  (1 unrouted)
N$1  (5 unrouted)
N$2  (1 unrouted)
N$3  (1 unrouted)
N$4  (1 unrouted)
N$5  (1 unrouted)
N$6  (1 unrouted)
N$7  (1 unrouted)
N$8  (2 unrouted)
N$9  (2 unrouted)
N$10  (1 unrouted)
N$11  (1 unrouted)
N$12  (1 unrouted)
N$13  (1 unrouted)
N$14  (1 unrouted)
N$15  (1 unrouted)
N$16  (4 unrouted)
N$17  (1 unrouted)
N$18  (1 unrouted)
N$19  (1 unrouted)
N$20  (2 unrouted)
N$21  (2 unrouted)
N$22  (2 unrouted)
N$23  (2 unrouted)
N$24  (3 unrouted)
N$25  (2 unrouted)
N$26  (3 unrouted)
N$27  (1 unrouted)
N$28  (1 unrouted)
N$29  (2 unrouted)
N$30  (2 unrouted)
N$31  (1 unrouted)
N$32  (2 unrouted)
N$33  (3 unrouted)
N$34  (2 unrouted)
N$35  (3 unrouted)
N$36  (1 unrouted)
N$37  (2 unrouted)
N$38  (1 unrouted)
N$39  (1 unrouted)
N$41
  Top 0.3: IC6.97 54.3,28.56 54.3,29.3 50.3,33.3 46.9,33.3 24.4,55.8 24.4,59.27 DISPLAY2.2
N$42  (2 unrouted)
N$43
  Top 0.3: IC6.98 53.8,28.77 53.8,29 50,32.8 46.7,32.8 23.8,55.7 23.8,57.33 DISPLAY2.4
N$44
  Top 0.3: IC6.1 22.73,56.05 DISPLAY2.6
N$45
  Top 0.3: IC6.2 24.57,53.51 DISPLAY2.8
N$46  (via drill 0.3 pad 0.6)
  Top 0.3: DISPLAY2.34 26.31,20.49 37.2,9.6 v37.2,9.1 | v41.2,13.1 41.2,13.34 IC6.32
  Bottom 0.3: DISPLAY2.22 21.31,34.5 19.5,34.5 17.7,32.7 17.7,20.7 19.2,19.2 21.25,19.2 DISPLAY2.34 | v37.2,9.1 v41.2,13.1
N$47
  Top 0.3: IC6.3 26.4,50.97 DISPLAY2.10
N$48
  Top 0.3: IC6.4 28.23,48.43 DISPLAY2.12
N$49
  Top 0.3: IC6.5 46.13,29.83 30.07,45.89 DISPLAY2.14
N$50
  Top 0.3: DISPLAY2.16 27.2,38.69 27.2,25.9 41.4,11.7 43.8,11.7 IC6.38
N$51  (via drill 0.3 pad 0.6)
  Top 0.3: IC6.31 41.55,14.4 39.4,14.4 28.2,25.6 v28.2,25.9
  Bottom 0.3: DISPLAY2.26 21.3,29.41 21.3,27.7 20.5,26.9 19.5,26.9 18.7,26.1 18.7,25 19.4,24.3 21.27,24.3 DISPLAY2.30 22.87,25.9 v28.2,25.9
N$52  (via drill 0.3 pad 0.6)
  Top 0.3: IC6.30 41.34,14.9 39.6,14.9 31.9,22.6 v31.9,23
  Bottom 0.3: DISPLAY2.18 21.3,39.57 21.3,37.5 21.8,37 23.3,37 23.8,36.5 23.8,32.6 23.1,31.9 19.2,31.9 18.2,30.9 18.2,22.6 19.1,21.7 21.21,21.7 DISPLAY2.32 22.57,23 v31.9,23
N$53  (2 unrouted)
N$54  (2 unrouted)
N$55
  Top 0.3: R21.2 92.81,13.02 X1.2
N$56
  Top 0.3: R22.2 90.25,14.3 93.56,14.3 X1.3
N$58  (1 unrouted)
N$59  (3 unrouted)
N$60  (3 unrouted)
N$61  (1 unrouted)
N$62
  Top 0.3: DISPLAY2.13 20,45.2 21.3,43.9 21.3,42.8 22,42.1 22.9,42.1 26.7,38.3 26.7,25.7 41.2,11.2 44.01,11.2 IC6.39
N$63
  Top 0.3: DISPLAY2.15 20,42.6 21.3,41.3 21.3,40.3 22.1,39.5 23.2,39.5 26.2,36.5 26.2,25.5 41,10.7 44.21,10.7 IC6.40
N$64
  Top 0.3: DISPLAY2.17 20,40.2 21.3,38.9 21.3,37.5 21.8,37 23,37 25.7,34.3 25.7,25.3 40.8,10.2 44.42,10.2 IC6.41
N$65
  Top 0.3: DISPLAY2.19 20,37.5 21.2,36.3 21.2,35.2 22,34.4 23,34.4 25.2,32.2 25.2,25.1 40.6,9.7 44.63,9.7 IC6.42
N$66  (1 unrouted)
N$67  (2 unrouted)
N$68
  Top 0.3: DISPLAY2.21 20,35 21.3,33.7 21.3,32.5 21.9,31.9 23.1,31.9 24.7,30.3 24.7,24.9 40.4,9.2 44.84,9.2 IC6.43
N$69
  Top 0.3: DISPLAY2.23 20,32.6 21.3,31.3 21.3,30.1 22,29.4 23.2,29.4 24.2,28.4 24.2,24.7 40.2,8.7 45.04,8.7 IC6.44
N$70
  Top 0.3: DISPLAY2.25 20,29.8 21.3,28.5 21.3,27.5 21.9,26.9 23,26.9 23.7,26.2 23.7,24.5 40,8.2 45.25,8.2 IC6.45
N$71
  Top 0.3: DISPLAY2.27 20,27.3 21.2,26.1 21.2,25.1 22,24.3 23.2,24.3 39.8,7.7 45.46,7.7 IC6.46
N$72  (2 unrouted)
RX  (1 unrouted)
SD_CS  (via drill 0.3 pad 0.6)
  Top 0.3: DISPLAY2.36 28.05,17.95 34.1,11.9 v34.1,11.4 | v39.2,16.5 40.12,16.5 IC6.26
  Bottom 0.3: v34.1,11.4 v39.2,16.5
SOUND  (1 unrouted)
SWCLK  (1 unrouted)
SWDIO  (1 unrouted)
TFT_CS  (via drill 0.3 pad 0.6)
  Top 0.3: v28.2,26.9 35.62,26.9 IC6.24
  Bottom 0.3: DISPLAY2.29 21.33,26.9 v28.2,26.9
TFT_RD  (via drill 0.3 pad 0.6)
  Top 0.3: IC6.9 46.2,26.93 46.2,27.6 31.2,42.6 26.9,42.6 v25.9,43.6
  Bottom 0.3: v25.9,43.6 25.9,45.1 23.8,47.2 21.23,47.2 DISPLAY2.11
TFT_RS
  Top 0.3: IC6.7 47.2,27.34 47.2,28 30.6,44.6 22,44.6 21.3,45.3 21.3,52.21 DISPLAY2.7
TFT_RST  (via drill 0.3 pad 0.6)
  Top 0.3: IC6.25 40.02,21.8 v34,21.8
  Bottom 0.3: DISPLAY2.33 20.89,20.49 22.2,21.8 v34,21.8
TFT_WR  (via drill 0.3 pad 0.6)
  Top 0.3: IC6.8 46.7,27.14 46.7,27.8 30.9,43.6 v27.4,43.6
  Bottom 0.3: v27.4,43.6 27.4,45.9 23.6,49.7 21.27,49.7 DISPLAY2.9
TOUCH_CS  (via drill 0.3 pad 0.6)
  Top 0.3: IC6.10 45.7,26.72 45.7,27.3 34.7,38.3 v28.7,38.3
  Bottom 0.3: v28.7,38.3 22.57,38.3 DISPLAY2.20
TOUCH_IRQ  (via drill 0.3 pad 0.6)
  Top 0.3: v28.2,28.1 35.13,28.1 IC6.23
  Bottom 0.3: DISPLAY2.28 v28.19,28.11 v28.2,28.1
TX  (1 unrouted)
U+  (1 unrouted)
U-  (1 unrouted)
USB_N
  Top 0.3: IC6.70 61.85,13.4 87.3,13.4 88.05,13.4 R21.1
USB_P  (1 unrouted)
  Top 0.3: IC6.71 61.96,14 88.01,14 R22.1
VCC  (10 unrouted)